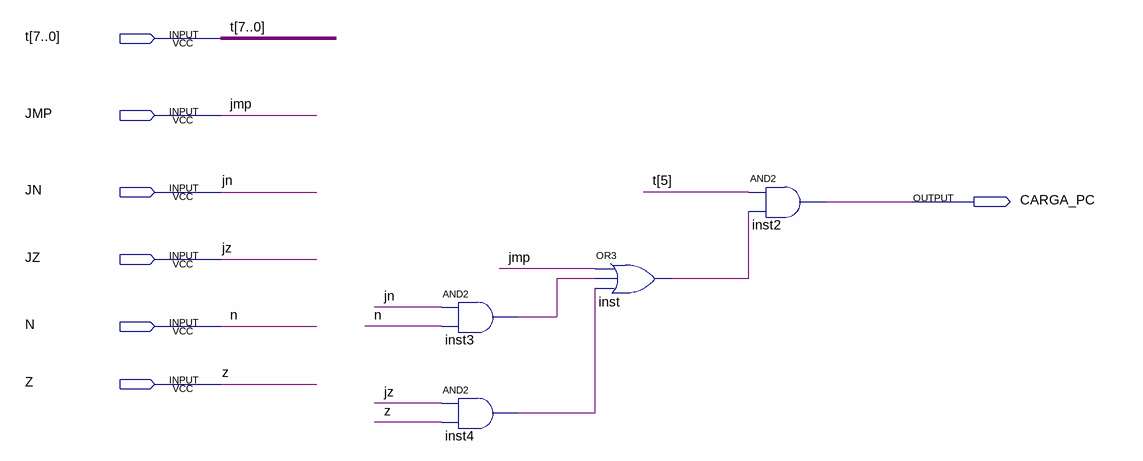
[diagram p0: schematic sheet]
// Quartus schematic CARGA_PC.bdf as structural Verilog: 4 symbols, 7 pins
module CARGA_PC (
  input  [7:0] t,
  input  JMP,
  input  JN,
  input  JZ,
  input  N,
  input  Z,
  output CARGA_PC
);

  wire inst3_out, inst4_out, inst_out;

  and inst3 (inst3_out, JN, N);
  and inst4 (inst4_out, JZ, Z);
  or inst (inst_out, JMP, inst3_out, inst4_out);
  and inst2 (CARGA_PC, t[5], inst_out);
endmodule
